# Altium project PCB_Project.PrjPcb
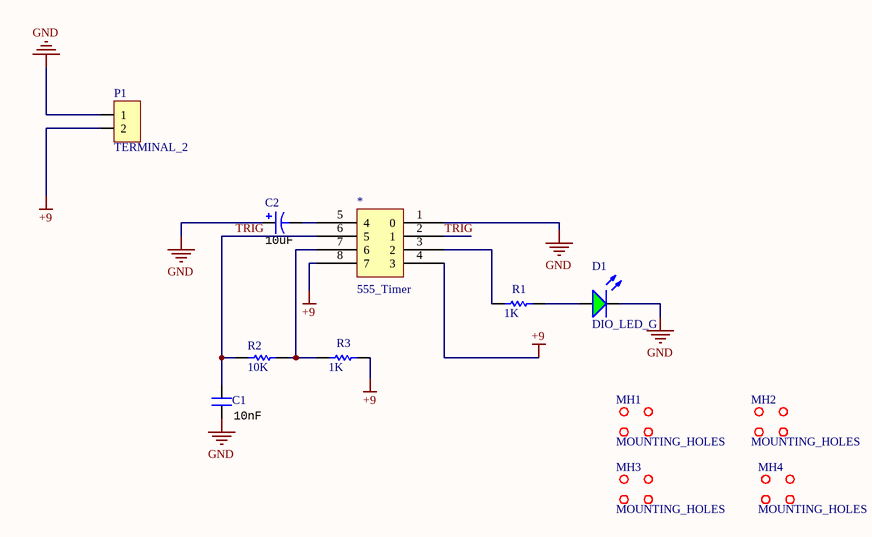
[diagram p0: main.SchDoc]
1 sheet, 12 parts. Net scope: global (net labels, ports and power ports of the same name join across sheets).
Board file: main.PcbDoc

## Sheet main.SchDoc: 555 Timer
size Letter; DrawnBy: Qinyang Bao

### Parts
*  555_Timer
C1  value 10nF  [CAPC0603(1608)55_N]  (hidden comment: CAP_10nF_0603)
C2  value 10uF  [AVX-CAPC3528_V]  (hidden comment: CAP_10uF_1411_POL)
D1  DIO_LED_G  [LED_0805_LINE]
MH1  MOUNTING_HOLES  [MOUNTING_HOLE]
MH2  MOUNTING_HOLES  [MOUNTING_HOLE]
MH3  MOUNTING_HOLES  [MOUNTING_HOLE]
MH4  MOUNTING_HOLES  [MOUNTING_HOLE]
P1  TERMINAL_2  [OSTYK51102030]
R1  value 1K  [RESC0603(1608)_N]  (hidden comment: RES_1K_0603)
R2  value 10K  [RESC0603(1608)_N]  (hidden comment: RES_10K_0603)
R3  value 1K  [RESC0603(1608)_N]  (hidden comment: RES_1K_0603)

### Nets
+9: *.4(3) *.8(7) P1.2 R3.2
GND: *.1(0) C1.1 C2.1 D1.2(K) P1.1
TRIG: *.2(1) *.6(5) C1.2 R2.1
Net*_3: *.3(2) R1.1
Net*_5: *.5(4) C2.2
Net*_7: *.7(6) R2.2 R3.1
NetD1_1: D1.1(A) R1.2

### Notes on the sheet
- Title
- Size:
- Date:
- Letter
- Drawn By:
- Sheet
- of
- File:

### Library data of the parts
C1 = CAP_10nF_0603: CAP CER 10000PF 16V X7R 0603; MPN: CC0603KRX7R7BB103; Manufacturer: Yageo; Dimensions: 0.063" L x 0.031" W (1.60mm x 0.80mm); Package: 0603 (1608 Metric); Temperature Coefficient: X7R; Voltage Rating: 16V; Digikey Part Number: 311-3369-1-ND
C2 = CAP_10uF_1411_POL: CAP TANT 10UF 20% 10V 1411; MPN: F971A106MBAHT3; Manufacturer: AVX Corporation; Dimensions: 0.063" L x 0.031" W (1.60mm x 0.80mm); Package: 1411 (3528 Metric); Voltage Rating: 10V; Digikey Part Number: 478-12047-1-ND
D1 = DIO_LED_G: LED GREEN DIFFUSED 0805 SMD; MPN: LG R971-KN-1; Manufacturer: OSRAM; Forward Voltage Drop: 2.2V; Package: 0805 (2012 Metric); Digikey Part Number: 475-1410-1-ND
MH1-MH4 = MOUNTING_HOLES: 6cm x 6cm
P1 = TERMINAL_2: Header, 2-Pin; Manufacturer: On Shore Technology Inc.; MPN: OSTYK51102030; Digikey Part Number: ED2953-ND
R1 R3 = RES_1K_0603: RES SMD 1K OHM 5% 1/10W 0603; Manufacturer: Yageo; MPN: RC0603JR-071KL; Dimensions: 0.063" L x 0.031" W (1.60mm x 0.80mm); Tolerance: 5%; Package: 0603 (1608 Metric); Digikey Part Number: 311-1.0KGRCT-ND
R2 = RES_10K_0603: RES SMD 10K OHM 5% 1/10W 0603; Manufacturer: Yageo; MPN: RC0603JR-0710KL; Package: 0603 (1608 Metric); Dimensions: 0.063" L x 0.031" W (1.60mm x 0.80mm); Tolerance: 5%; Digikey Part Number: 311-10KGRCT-ND